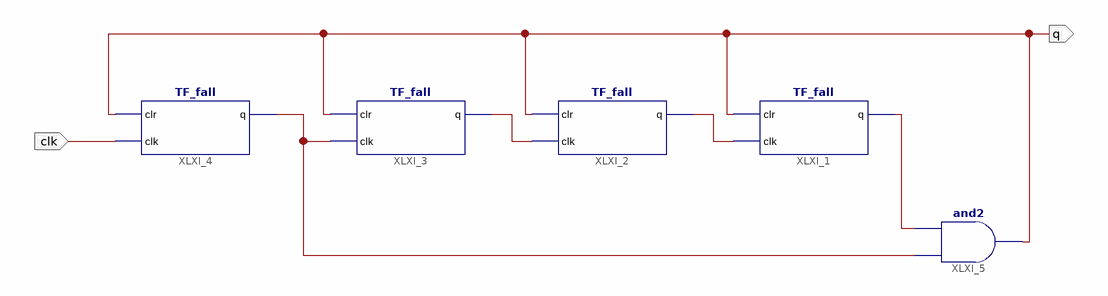
[diagram p0: schematic sheet 1]
// Xilinx ISE schematic counter0_8.sch (spartan6) as structural Verilog: 5 symbols, 2 ports
module counter0_8 (
  input  clk,
  output q
);

  wire XLXN_1, XLXN_2, XLXN_7, XLXN_10;

  TF_fall XLXI_1 (.clr(q), .clk(XLXN_7), .q(XLXN_10));
  TF_fall XLXI_2 (.clr(q), .clk(XLXN_2), .q(XLXN_7));
  TF_fall XLXI_3 (.clr(q), .clk(XLXN_1), .q(XLXN_2));
  TF_fall XLXI_4 (.clr(q), .clk(clk), .q(XLXN_1));
  and XLXI_5 (q, XLXN_1, XLXN_10);
endmodule
